# EAGLE schematic Circuit (EAGLE 5.00)
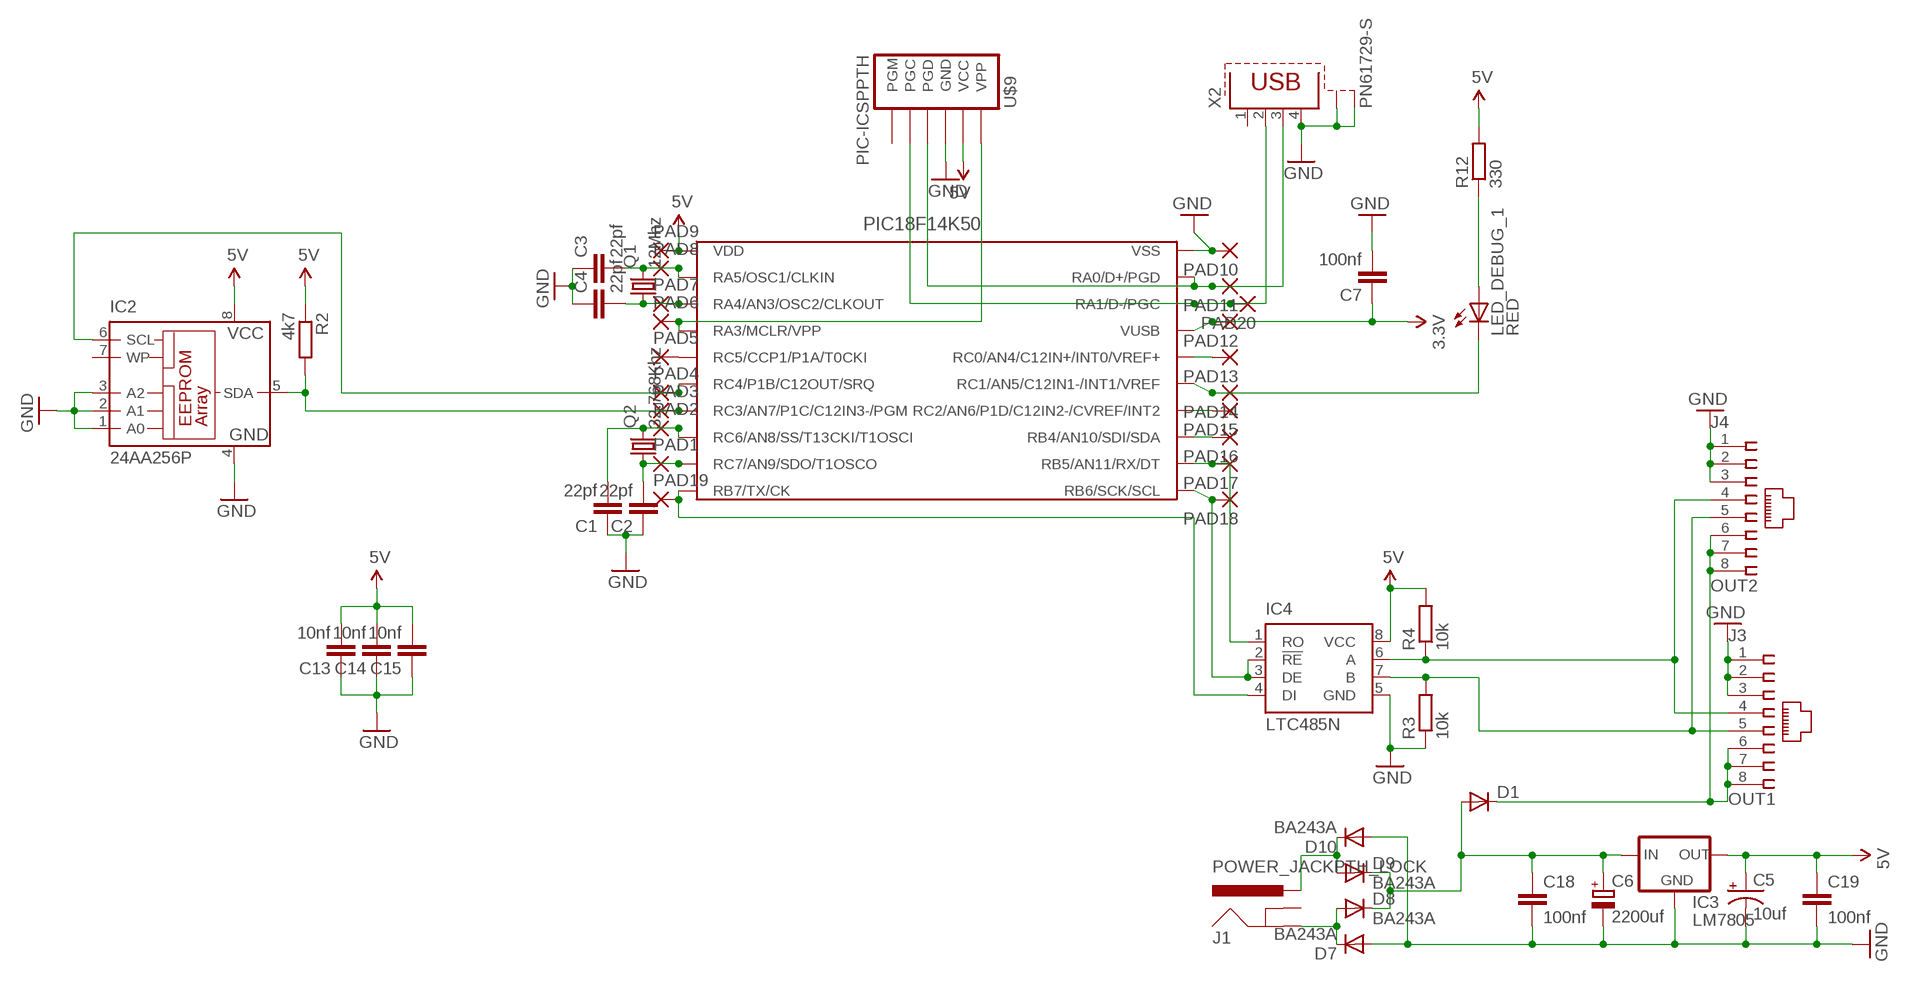
[diagram p0: schematic, sheet 1]

## Parts
C1  22pf  C2.5/2  [C2.5-2]
C2  22pf  C2.5/2  [C2.5-2]
C3  22pf  C2.5/2  [C2.5-2]
C4  22pf  C2.5/2  [C2.5-2]
C5  10uf  CAP_POLPTH1  [CPOL-RADIAL-100UF-25V]
C6  2200uf  CPOL-EUE5-13  [E5-13]
C7  100nf  C2.5/2  [C2.5-2]
C13  10nf  C2.5/2  [C2.5-2]
C14  10nf  C2.5/2  [C2.5-2]
C15  10nf  C2.5/2  [C2.5-2]
C18  100nf  C2.5/2  [C2.5-2]
C19  100nf  C2.5/2  [C2.5-2]
D1  DIODE-D-7.5  [D-7.5]
D7  BA243A  [DO35-10]
D8  BA243A  [DO35-10]
D9  BA243A  [DO35-10]
D10  BA243A  [DO35-10]
IC2  24AA256P  [DIL8]
IC3  LM7805  78XXS  [78XXS]
IC4  LTC485N  [DIL08]
J1  POWER_JACKPTH_LOCK  [POWER_JACK_PTH_LOCK]
J3  OUT1  215877-4  [215877-4]
J4  OUT2  215877-4  [215877-4]
LED_DEBUG_1  RED  LED3MM  [LED3MM]
PAD1  2,15/1,0  [2,15/1,0]
PAD2  2,15/1,0  [2,15/1,0]
PAD3  2,15/1,0  [2,15/1,0]
PAD4  2,15/1,0  [2,15/1,0]
PAD5  2,15/1,0  [2,15/1,0]
PAD6  2,15/1,0  [2,15/1,0]
PAD7  2,15/1,0  [2,15/1,0]
PAD8  2,15/1,0  [2,15/1,0]
PAD9  2,15/1,0  [2,15/1,0]
PAD10  2,15/1,0  [2,15/1,0]
PAD11  2,15/1,0  [2,15/1,0]
PAD12  2,15/1,0  [2,15/1,0]
PAD13  2,15/1,0  [2,15/1,0]
PAD14  2,15/1,0  [2,15/1,0]
PAD15  2,15/1,0  [2,15/1,0]
PAD16  2,15/1,0  [2,15/1,0]
PAD17  2,15/1,0  [2,15/1,0]
PAD18  2,15/1,0  [2,15/1,0]
PAD19  2,15/1,0  [2,15/1,0]
PAD20  2,15/1,0  [2,15/1,0]
Q1  12Mhz  CRYSTALHC49U70  [HC49U70]
Q2  32.768Khz  CRYSTALTC38H  [TC38H]
R2  4k7  R-EU_0204/7  [0204/7]
R3  10k  R-EU_0204/5  [0204/5]
R4  10k  R-EU_0204/5  [0204/5]
R12  330  R-EU_0207/2V  [0207/2V]
U$1  D.2.18F14K50  [E.18F14K50]
U$9  PIC-ICSPPTH  [MOLEX-1X6]
X2  PN61729-S  [PN61729-S]

## Nets
3.3V: C7.1 PAD12.1(P) U$1.VUSB
5V: C5.1(+) C13.2 C14.2 C15.2 C19.1 IC2.8(VCC) IC3.OUT IC4.8(VCC) PAD9.1(P) R2.1 R4.2 R12.2 U$1.VDD U$9.5(VCC)
12V: C6.+ C18.1 D1.A D8.C D9.C IC3.IN
GND: C1.1 C2.1 C3.1 C4.1 C5.2(-) C6.- C7.2 C13.1 C14.1 C15.1 C18.2 C19.2 D7.A D10.A IC2.1(A0) IC2.2(A1) IC2.3(A2) IC2.4(GND) IC3.GND IC4.5(GND) J3.1 J3.2 J3.3 J4.1 J4.2 J4.3 PAD10.1(P) R3.1 U$1.VSS U$9.4(GND) X2.4 X2.S1 X2.S2
N$1: IC2.6(SCL) PAD4.1(P) U$1.RC4/P1B/C12OUT/SRQ
N$2: PAD5.1(P) U$1.RC5/CCP1/P1A/T0CKI
N$3: PAD13.1(P) U$1.RC0/AN4/C12IN+/INT0/VREF+
N$4: D7.C D8.A J1.GND
N$5: IC4.1(RO) PAD17.1(P) U$1.RB5/AN11/RX/DT
N$6: IC4.6(A) J3.4 J4.4 R4.1
N$7: IC4.2(!RE) IC4.3(DE) PAD18.1(P) U$1.RB6/SCK/SCL
N$8: D9.A D10.C J1.PWR
N$9: C1.2 PAD2.1(P) Q2.2 U$1.RC6/AN8/SS/T13CKI/T1OSCI
N$10: C2.2 PAD1.1(P) Q2.1 U$1.RC7/AN9/SDO/T1OSCO
N$11: PAD15.1(P) U$1.RC2/AN6/P1D/C12IN2-/CVREF/INT2
N$12: IC2.5(SDA) PAD3.1(P) R2.2 U$1.RC3/AN7/P1C/C12IN3-/PGM
N$13: IC4.7(B) J3.5 J4.5 R3.2
N$14: C4.2 PAD7.1(P) Q1.1 U$1.RA4/AN3/OSC2/CLKOUT
N$15: C3.2 PAD8.1(P) Q1.2 U$1.RA5/OSC1/CLKIN
N$16: PAD16.1(P) U$1.RB4/AN10/SDI/SDA
N$19: D1.C J3.6 J3.7 J3.8 J4.6 J4.7 J4.8
N$28: PAD6.1(P) U$1.RA3/MCLR/VPP U$9.6(VPP)
N$38: PAD11.1(P) U$1.RA0/D+/PGD U$9.3(PGD) X2.3
N$39: PAD20.1(P) U$1.RA1/D-/PGC U$9.2(PGC) X2.2
N$41: IC4.4(DI) PAD19.1(P) U$1.RB7/TX/CK
N$66: LED_DEBUG_1.A R12.1
N$67: LED_DEBUG_1.K(C) PAD14.1(P) U$1.RC1/AN5/C12IN1-/INT1/VREF
Unconnected: IC2.7(WP) J1.GNDBREAK U$9.1(PGM) X2.1

## Library data of the parts
C1-C4 C7 C13-C15 C18 C19 = capacitor-wima:C: CAPACITOR naming: grid - package width
C5 = SparkFun:CAP_POL: Capacitor Polarized These are standard SMD and PTH capacitors. Normally 10uF, 47uF, and 100uF in electrolytic and tantalum varieties. Always verify the external diameter of the through hole cap, it varies with capacity, voltage, and manufacturer. The EIA devices should be standard.
C6 = rcl:CPOL-EU: POLARIZED CAPACITOR, European symbol
D1 = diode:DIODE-: DIODE
D7-D10 = diode:BA243A: DIODE
IC2 = microchip:24*: Serial EEPROM I2C
IC3 = v-reg:78XXS: VOLTAGE REGULATOR
IC4 = linear-technology:LTC485: Low Power RS485 Interface Transceiver Source: http://www.linear.com/pc/downloadDocument.do?navId=H0,C1,C1007,C1017,P2064,D1718
J1 = SparkFun:POWER_JACK: Power Jack This is the standard 5.5mm barrel jack for power. The PTH is the most common, proven, reliable, footprint. All others are experimental. The Slot footprint only works if the mill layer is transmitted to the PCB fab house so be warned. Spark Fun Electronics SKU : PRT-00119. Mating wall wart : TOL-00298 (and others)
J3 J4 = con-amp:215877-4: AMP connector
LED_DEBUG_1 = SparkFun:LED: LEDs Standard schematic elements and footprints for 5mm, 3mm, 1206, and 0603 sized LEDs. 5mm - Spark Fun Electronics SKU : COM-00529 (and others)
PAD1-PAD20 = wirepad:2,15/1,0: THROUGH-HOLE PAD
Q1 Q2 = crystal:CRYSTAL: CRYSTAL
R2-R4 R12 = resistor:R-EU_: RESISTOR, European symbol
U$1 = pic18f14k50:D.2.18F14K50
U$9 = SparkFun:PIC-ICSP: ISCP Programming connector for UAV, UBW Kit, etc.
X2 = con-berg:PN61729-S: BERG USB connector